# Altium schematic sheet usage_monitoring_unit.SchDoc
size A3
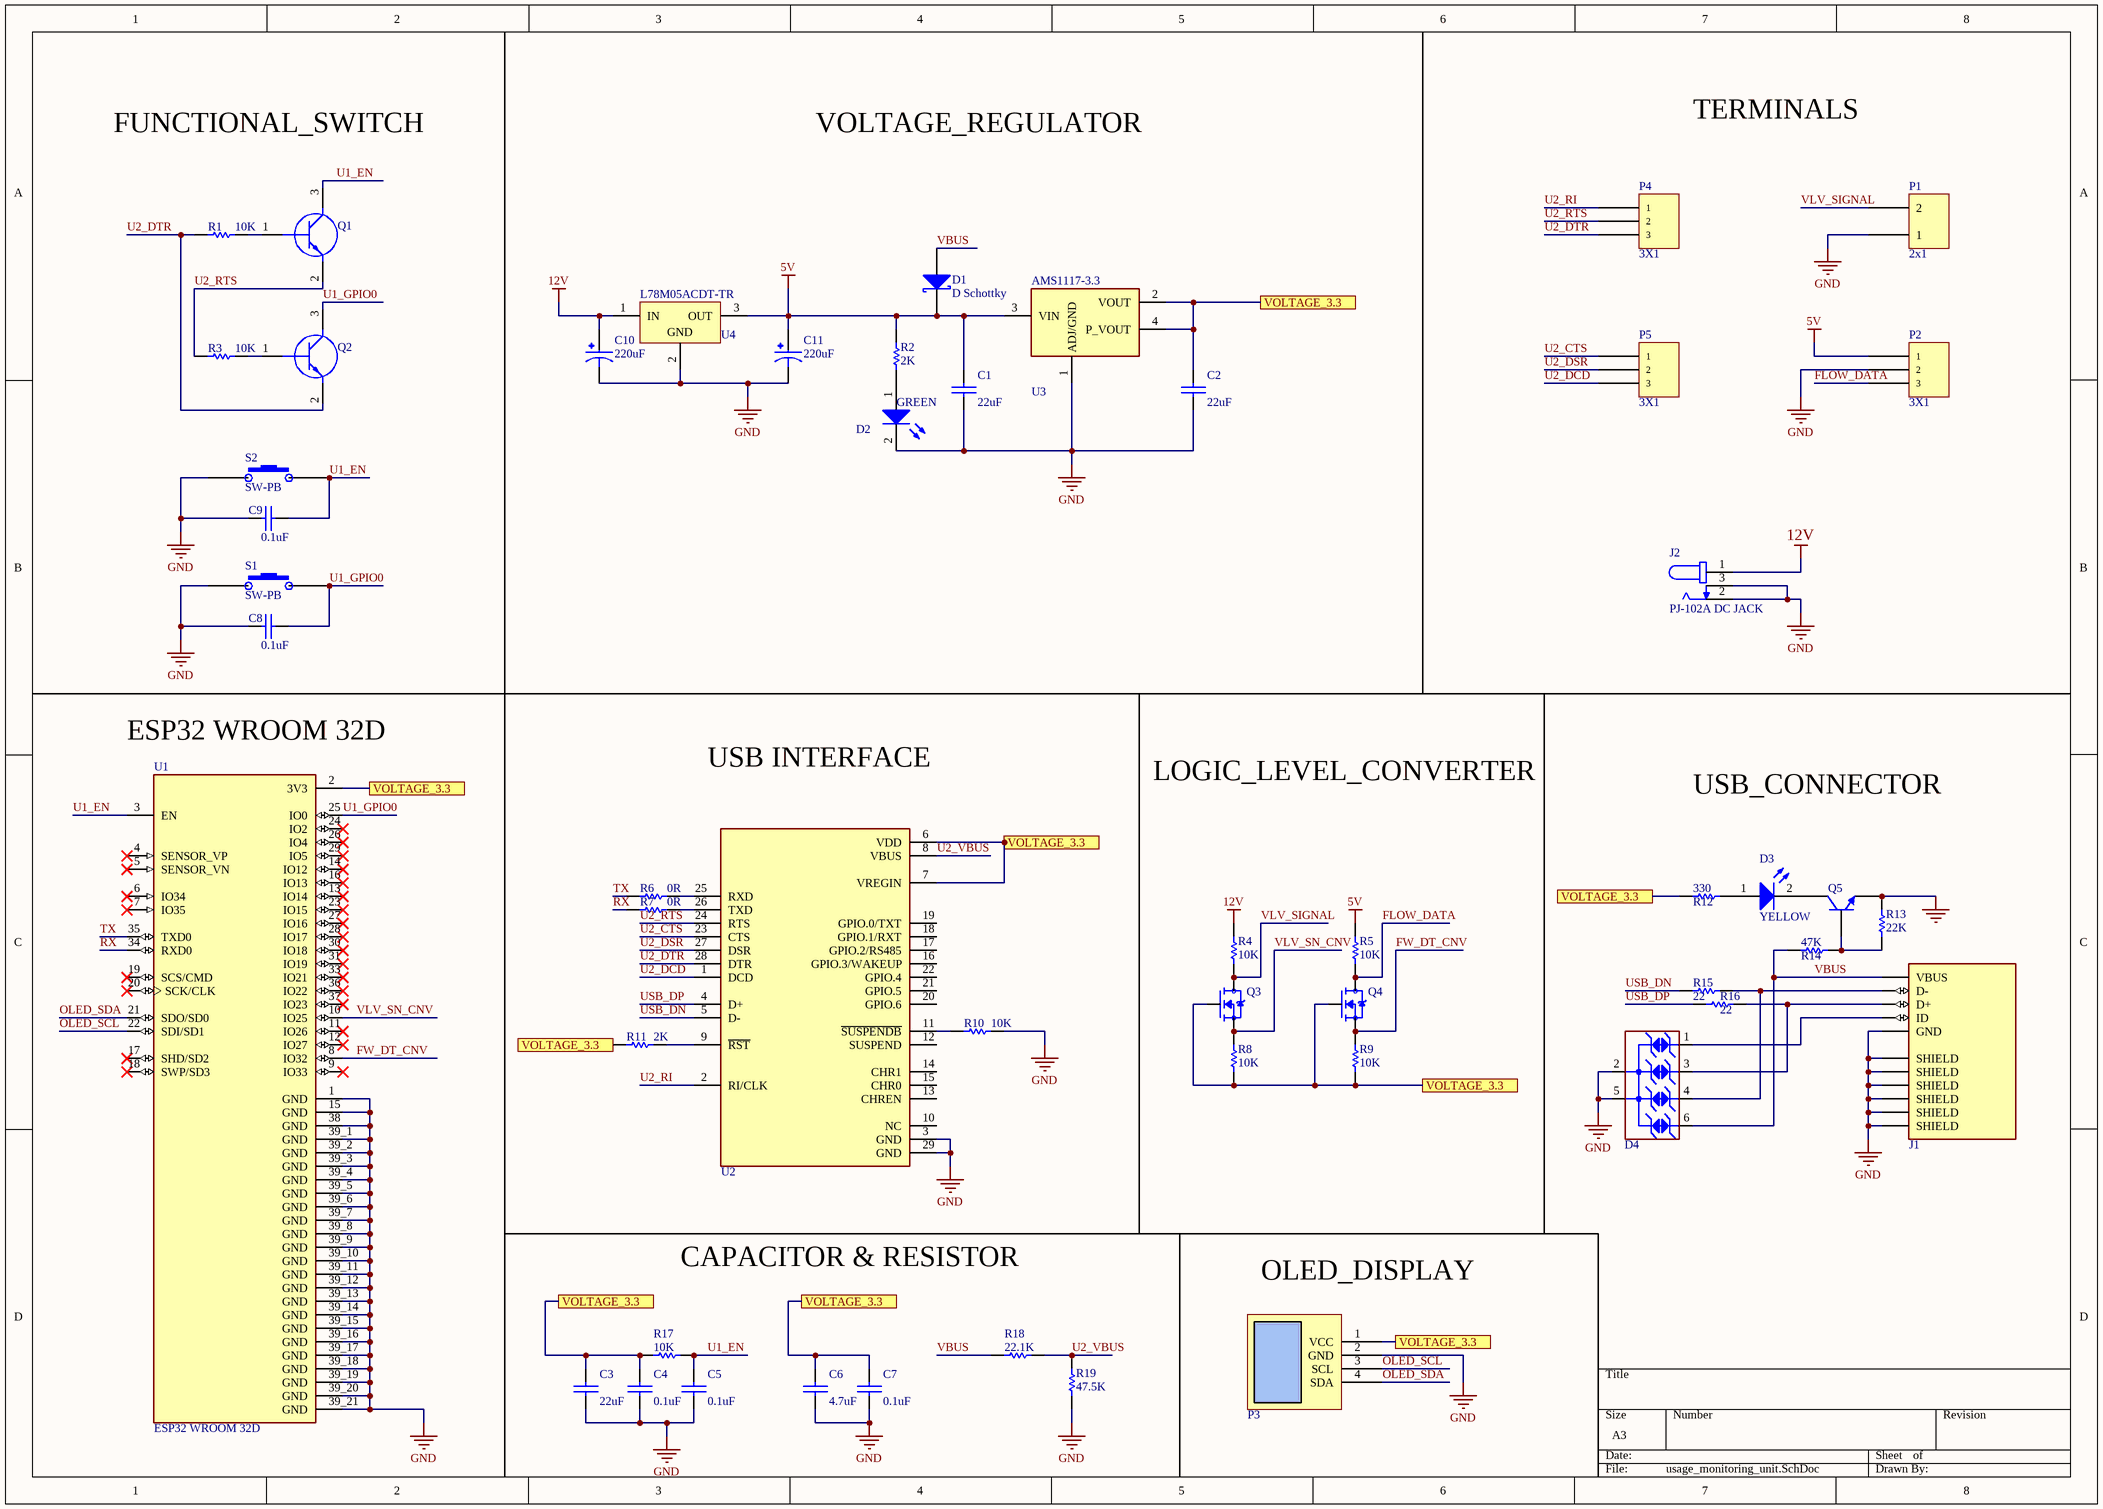
[diagram p0: usage_monitoring_unit.SchDoc]

## Parts
C1  22uF  [CAPACITOR SMD]
C2  22uF  [CAPACITOR SMD]
C3  22uF  [CAPACITOR SMD]
C4  0.1uF  [CAPACITOR SMD]
C5  0.1uF  [CAPACITOR SMD]
C6  4.7uF  [CAPACITOR SMD]
C7  0.1uF  [CAPACITOR SMD]
C8  0.1uF  [CAPACITOR SMD]
C9  0.1uF  [CAPACITOR SMD]
C10  220uF  [TAJC226K025RNJ]
C11  220uF  [TAJC226K025RNJ]
D1  D Schottky  [SMB]
D2  GREEN  [LED SMD]
D3  YELLOW  [LED SMD]
D4  ESDA6V1BC6  [ESDA6V1BC6]  (value not drawn)
J1  USB B MICRO  [USB3076-XX-X_REVC]  (value not drawn)
J2  PJ-102A DC JACK  [PJ-102A]
P1  2x1  [MALE HEADER 2x1]
P2  3X1  [MALE HEADER 3X1]
P3  OLED DISPLAY  [OLED DISPLAY]  (value not drawn)
P4  3X1  [FEMALE HEADER 3X1]
P5  3X1  [FEMALE HEADER 3X1]
Q1  SS8050-G  [SS8050-G]  (value not drawn)
Q2  SS8050-G  [SS8050-G]  (value not drawn)
Q3  N CHANNEL FIELD EFFECT TRANSISTOR  [BSS-138]  (value not drawn)
Q4  N CHANNEL FIELD EFFECT TRANSISTOR  [BSS-138]  (value not drawn)
Q5  ID  [NPN SOT-23]  (value not drawn)
R1  10K  [RESISTOR SMD]
R2  2K  [RESISTOR SMD]
R3  10K  [RESISTOR SMD]
R4  10K  [RESISTOR SMD]
R5  10K  [RESISTOR SMD]
R6  0R  [RESISTOR SMD]
R7  0R  [RESISTOR SMD]
R8  10K  [RESISTOR SMD]
R9  10K  [RESISTOR SMD]
R10  10K  [RESISTOR SMD]
R11  2K  [RESISTOR SMD]
R12  330  [RESISTOR SMD]
R13  22K  [RESISTOR SMD]
R14  47K  [RESISTOR SMD]
R15  22  [RESISTOR SMD]
R16  22  [RESISTOR SMD]
R17  10K  [RESISTOR SMD]
R18  22.1K  [RESISTOR SMD]
R19  47.5K  [RESISTOR SMD]
S1  SW-PB  [PUSH BUTTON 2PIN]
S2  SW-PB  [PUSH BUTTON 2PIN]
U1  ESP32 WROOM 32D  [ESP32 WROOM 32D 4MB]
U2  CP2102N-A01-GQFN28  [CP2102N-A01-GQFN28]  (value not drawn)
U3  AMS1117-3.3  [AMS1117-3.3]
U4  L78M05ACDT-TR  [L78M05ACDT-TR]

## Ports
VOLTAGE_3.3

## Nets
5V: C1.1 C11.1 D1.2(K) P2.1 R2.1 R5.2 U3.3(VIN) U4.3(OUT)
12V: C10.1 J2.1 R4.2 U4.1(IN)
GND: C1.2 C2.2 C3.2 C4.2 C5.2 C6.2 C7.2 C8.1 C9.1 C10.2 C11.2 D2.2(K) D4.2(IO2) D4.5(IO4) J1.5(GND) J1.6(SHIELD) J1.7(SHIELD) J1.8(SHIELD) J1.9(SHIELD) J1.10(SHIELD) J1.11(SHIELD) J2.2 J2.3 P1.1 P2.2 P3.2(GND) Q5.2(E) R10.2 R13.2 R19.1 S1.2 S2.2 U1.1(GND) U1.15(GND) U1.38(GND) U1.39_1(GND) U1.39_2(GND) U1.39_3(GND) U1.39_4(GND) U1.39_5(GND) U1.39_6(GND) U1.39_7(GND) U1.39_8(GND) U1.39_9(GND) U1.39_10(GND) U1.39_11(GND) U1.39_12(GND) U1.39_13(GND) U1.39_14(GND) U1.39_15(GND) U1.39_16(GND) U1.39_17(GND) U1.39_18(GND) U1.39_19(GND) U1.39_20(GND) U1.39_21(GND) U2.3(GND) U2.29(GND) U3.1(ADJ/GND) U4.2(GND)
FLOW_DATA: P2.3 Q4.3(D) R5.1
FW_DT_CNV: Q4.2(S) R9.2 U1.8(IO32)
OLED_SCL: P3.3(SCL) U1.22(SDI/SD1)
OLED_SDA: P3.4(SDA) U1.21(SDO/SD0)
RX: R7.1 U1.34(RXD0)
TX: R6.1 U1.35(TXD0)
U1_EN: C5.1 C9.2 Q1.3(C) R17.2 S2.1 U1.3(EN)
U1_GPIO0: C8.2 Q2.3(C) S1.1 U1.25(IO0)
U2_CTS: P5.1 U2.23(CTS)
U2_DCD: P5.3 U2.1(DCD)
U2_DSR: P5.2 U2.27(DSR)
U2_DTR: P4.3 Q2.2(E) R1.1 U2.28(DTR)
U2_RI: P4.1 U2.2(RI/CLK)
U2_RTS: P4.2 Q1.2(E) R3.1 U2.24(RTS)
U2_VBUS: R18.2 R19.2 U2.8(VBUS)
USB_DN: R15.1 U2.5(D-)
USB_DP: R16.1 U2.4(D+)
VBUS: D1.1(A) D4.6(NC) J1.1(VBUS) R14.1 R18.1
VLV_SIGNAL: P1.2 Q3.3(D) R4.1
VLV_SN_CNV: Q3.2(S) R8.2 U1.10(IO25)
VOLTAGE_3.3: C2.1 C3.1 C4.1 C6.1 C7.1 P3.1(VCC) Q3.1(G) Q4.1(G) R8.1 R9.1 R11.1 R12.1 R17.1 U1.2(3V3) U2.6(VDD) U2.7(VREGIN) U3.2(VOUT) U3.4(P_VOUT) ; port VOLTAGE_3.3
NetD2_1: D2.1(A) R2.2
NetD3_1: D3.1(A) R12.2
NetD3_2: D3.2(K) Q5.3(C)
NetD4_1: D4.1(IO1) J1.4(ID)
NetD4_3: D4.3(GND) J1.3(D+) R16.2
NetD4_4: D4.4(IO3) J1.2(D-) R15.2
NetQ1_1: Q1.1(B) R1.2
NetQ2_1: Q2.1(B) R3.2
NetQ5_1: Q5.1(B) R13.1 R14.2
NetR6_2: R6.2 U2.25(RXD)
NetR7_2: R7.2 U2.26(TXD)
NetR10_1: R10.1 U2.11(~{SUSPENDB})
NetR11_2: R11.2 U2.9(~{RST})

Not connected (* = marked no-connect by the designer): U1 4(SENSOR_VP)* 5(SENSOR_VN)* 6(IO34)* 7(IO35)* 9(IO33)* 11(IO26)* 12(IO27)* 13(IO14)* 14(IO12)* 16(IO13)* 17(SHD/SD2)* 18(SWP/SD3)* 19(SCS/CMD)* 20(SCK/CLK)* 23(IO15)* 24(IO2)* 26(IO4)* 27(IO16)* 28(IO17)* 29(IO5)* 30(IO18)* 31(IO19)* 33(IO21)* 36(IO22)* 37(IO23)*; U2 10(NC) 12(SUSPEND) 13(CHREN) 14(CHR1) 15(CHR0) 16(GPIO.3/WAKEUP) 17(GPIO.2/RS485) 18(GPIO.1/RXT) 19(GPIO.0/TXT) 20(GPIO.6) 21(GPIO.5) 22(GPIO.4)

## Notes on the sheet
- FUNCTIONAL_SWITCH
- VOLTAGE_REGULATOR
- TERMINALS
- (near U1) ESP32 WROOM 32D
- USB INTERFACE
- LOGIC_LEVEL_CONVERTER
- USB_CONNECTOR
- CAPACITOR & RESISTOR
- OLED_DISPLAY

## Library data of the parts
C1-C9 = CAPACITOR SMD: CAPACITOR
C10 C11 = TAJC226K025RNJ: Tantalum Capacitors
D1 = D Schottky: Schottky Diode; Published: 8-Jun-2000; LatestRevisionDate: 17-Jul-2002; LatestRevisionNote: Re-released for DXP Platform.; PackageReference: SMB; Publisher: Altium Limited; PackageDescription: DO-214-AA/SMB; 2 C-Bend Leads; Body 5.3 x 3.6 mm, inc. leads (LxW); Code_JEDEC: DO-214-AA
D2 D3 = LED: SMD COMPONENT, Typical RED, GREEN, YELLOW, AMBER GaAs LED
D4 = ESDA6V1BC6: ESD PROTECTION
J1 = USB3076-XX-X_REVC: USB INTERFACE
J2 = PJ-102A DC JACK: 2.0 x 6.5 mm, 2.5 A, Horizontal, Through Hole, Tapered Pins, Dc Power Jack Connector
P1 = HEADER 2X1: 2.54 mm Male/Female Header
P2 P4 P5 = HEADER 3X1: 2.54 mm Male/Female Header
P3 = OLED DISPLAY: 0.96" OLED display 4 pin
Q1 Q2 = SS8050-G: Bipolar (BJT) Transistor NPN 25 V 1.5 A 100MHz 300 mW Surface Mount SOT-23-3
Q3 Q4 = BSS-138: MOSFET
Q5 = NPN TRANSISTOR: NPN Bipolar Transistor
R1-R19 = RESISTOR SMD: Resistor,12K1,0603,1%,VISHAY
S1 S2 = PUSH BUTTON 2PIN: 2 PIN- 5 mm
U1 = ESP32 WROOM 32D: 39 PIN RX TXRX MOD WIFI TRACE ANT SMD
U2 = CP2102N-A01-GQFN28: USB BRIDGE, USB to UART USB 2.0 UART INTERFACE 28-QFN
U3 = AMS1117-3.3: VOLTAGE REGULATOR INPUT-5V;OUTPUT-3V3
U4 = L78M05ACDT-TR: Linear Voltage Regulator IC Positive Fixed 1 Output 500mA DPAK